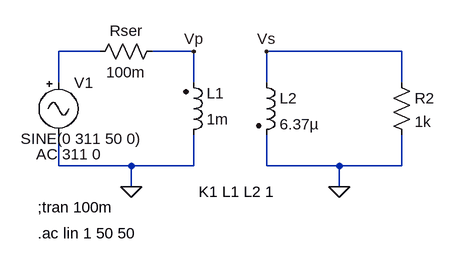
[diagram p0: schematic 3_12_pablo_gomez_tp4_ej1.asc]
3_12_pablo_gomez_tp4_ej1.asc, the LTspice schematic file:
Version 4
SHEET 1 880 740
WIRE -64 64 -128 64
WIRE 80 64 16 64
WIRE 400 64 192 64
WIRE -128 112 -128 64
WIRE 80 112 80 64
WIRE 192 112 192 64
WIRE 400 112 400 64
WIRE -128 240 -128 192
WIRE -16 240 -128 240
WIRE 80 240 80 192
WIRE 80 240 -16 240
WIRE 192 240 192 192
WIRE 304 240 192 240
WIRE 400 240 400 192
WIRE 400 240 304 240
WIRE -16 272 -16 240
WIRE 304 272 304 240
FLAG -16 272 0
FLAG 304 272 0
FLAG 80 64 Vp
FLAG 192 64 Vs
SYMBOL ind2 64 208 M180
WINDOW 0 36 80 Left 2
WINDOW 3 36 40 Left 2
SYMATTR InstName L1
SYMATTR Value 1m
SYMATTR Type ind
SYMBOL ind2 176 96 R0
SYMATTR InstName L2
SYMATTR Value 6.37µ
SYMATTR Type ind
SYMBOL Misc\\signal -128 96 R0
WINDOW 123 -34 126 Left 2
WINDOW 39 24 160 Left 2
WINDOW 3 -58 102 Left 2
SYMATTR Value2 AC 311 0
SYMATTR InstName V1
SYMATTR Value SINE(0 311 50 0)
SYMBOL res 384 96 R0
SYMATTR InstName R2
SYMATTR Value 1k
SYMBOL res 32 48 R90
WINDOW 0 0 56 VBottom 2
WINDOW 3 32 56 VTop 2
SYMATTR InstName Rser
SYMATTR Value 100m
TEXT 88 280 Left 2 !K1 L1 L2 1
TEXT -160 304 Left 2 !;tran 100m
TEXT -160 344 Left 2 !.ac lin 1 50 50

The netlist it stands for:
* 3_12_pablo_gomez_tp4_ej1.asc
L1 0 Vp 1m
L2 Vs 0 6.37µ
V1 N001 0 SINE(0 311 50 0) AC 311 0
R2 Vs 0 1k
Rser Vp N001 100m
K1 L1 L2 1
;tran 100m
.ac lin 1 50 50
.backanno
.end